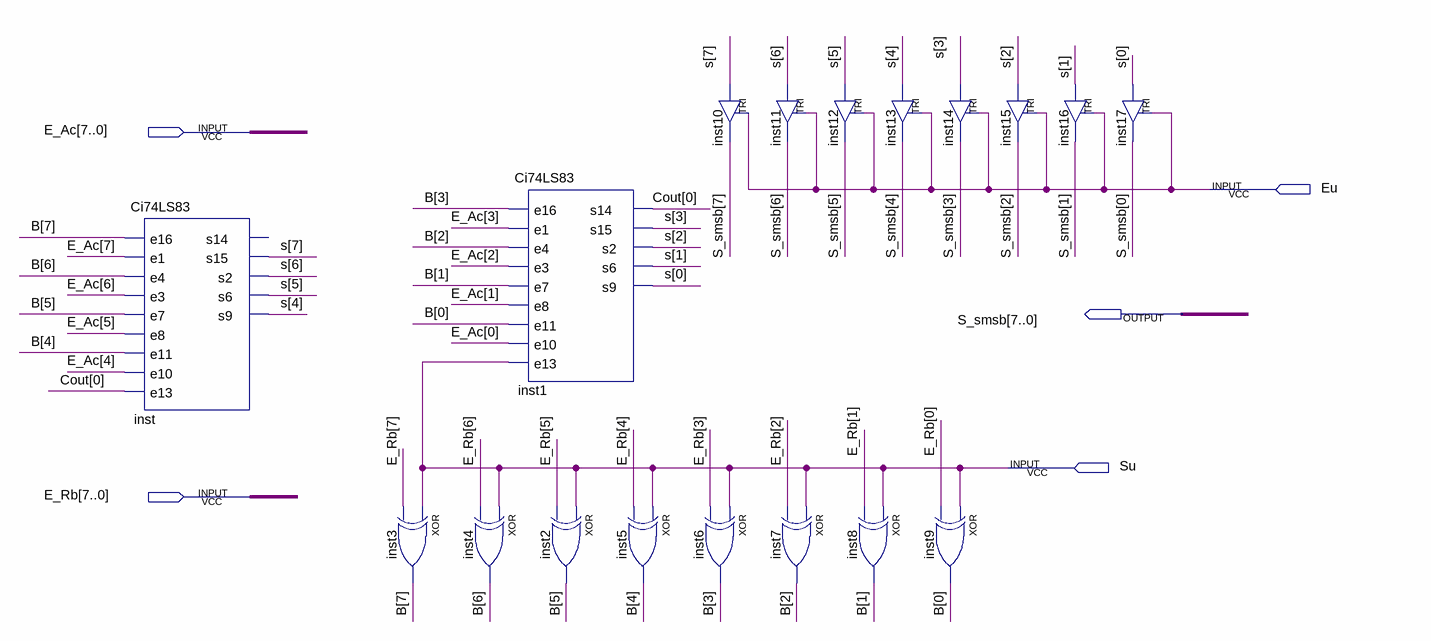
[diagram p0: schematic sheet]
// Quartus schematic Somador_Subtrator.bdf as structural Verilog: 18 symbols, 5 pins
module Somador_Subtrator (
  input  [7:0] E_Ac,
  input  Eu,
  input  Su,
  input  [7:0] E_Rb,
  output [7:0] S_smsb
);

  wire [0:0] Cout;
  wire [7:0] B, s;

  Ci74LS83 inst (
    .e16(B[7]), .e1(E_Ac[7]), .e4(B[6]), .e3(E_Ac[6]), .e7(B[5]), .e8(E_Ac[5]), .e11(B[4]), .e10(E_Ac[4]),
    .e13(Cout[0]), .s15(s[7]), .s2(s[6]), .s6(s[5]), .s9(s[4]));  // open: s14
  xor inst3 (B[7], Su, E_Rb[7]);
  xor inst4 (B[6], Su, E_Rb[6]);
  Ci74LS83 inst1 (
    .e16(B[3]), .e1(E_Ac[3]), .e4(B[2]), .e3(E_Ac[2]), .e7(B[1]), .e8(E_Ac[1]), .e11(B[0]), .e10(E_Ac[0]),
    .e13(Su), .s14(Cout[0]), .s15(s[3]), .s2(s[2]), .s6(s[1]), .s9(s[0]));
  xor inst2 (B[5], Su, E_Rb[5]);
  xor inst5 (B[4], Su, E_Rb[4]);
  xor inst6 (B[3], Su, E_Rb[3]);
  TRI inst10 (.IN(s[7]), .OE(Eu), .OUT(S_smsb[7]));
  TRI inst11 (.IN(s[6]), .OE(Eu), .OUT(S_smsb[6]));
  xor inst7 (B[2], Su, E_Rb[2]);
  TRI inst12 (.IN(s[5]), .OE(Eu), .OUT(S_smsb[5]));
  xor inst8 (B[1], Su, E_Rb[1]);
  TRI inst13 (.IN(s[4]), .OE(Eu), .OUT(S_smsb[4]));
  xor inst9 (B[0], Su, E_Rb[0]);
  TRI inst14 (.IN(s[3]), .OE(Eu), .OUT(S_smsb[3]));
  TRI inst15 (.IN(s[2]), .OE(Eu), .OUT(S_smsb[2]));
  TRI inst16 (.IN(s[1]), .OE(Eu), .OUT(S_smsb[1]));
  TRI inst17 (.IN(s[0]), .OE(Eu), .OUT(S_smsb[0]));
endmodule
